# Altium schematic sheet Pompe de charge.SchDoc: =SchTitle
size 276 x 198 mm; Organization: ETML; Address1: Rue de Sébeillon12; Address2: CH - 1004 Lausanne; Address3: Tél. 021 316 77 77; Address4: www.etml.ch; SheetNumber: 4; SheetTotal: 4; Replace: .; ModA: .; ModB: .; ModC: .; ModD: .
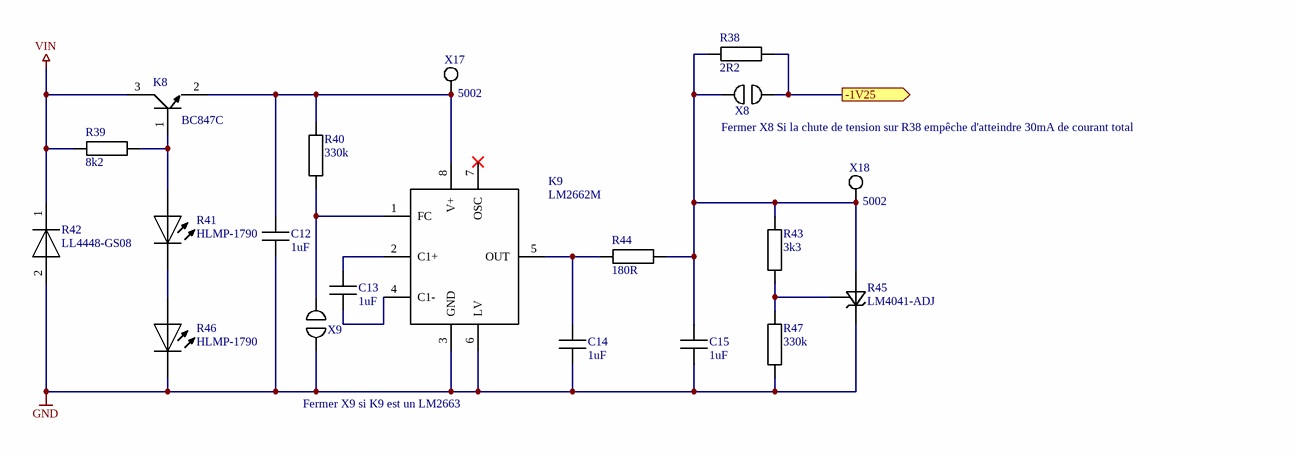
[diagram p0: Pompe de charge.SchDoc]

## Parts
C12  1uF  [CAPC2012X08M]
C13  1uF  [CAPC2012X08M]
C14  1uF  [CAPC2012X08M]
C15  1uF  [CAPC2012X08M]
K8  BC847C  [SOT90P240X110-3M]
K9  LM2662M  [D0008A_M]
R38  2R2  [RESC2012X06M]
R39  8k2  [RESC2012X06M]
R40  330k  [RESC2012X06M]
R41  HLMP-1790  [FP-6_544-5255_01-4-MFG]
R42  LL4448-GS08  [FP-6_560-5005_01-4-MFG]
R43  3k3  [RESC2012X06M]
R44  180R  [RESC2012X06M]
R45  LM4041-ADJ  [SOT90P240X110-3M]
R46  HLMP-1790  [FP-6_544-5255_01-4-MFG]
R47  330k  [RESC2012X06M]
X8  Solder bridge  [Solder brige]  (value not drawn)
X9  Solder bridge  [Solder brige]  (value not drawn)
X17  5002  [Keystone_5002]
X18  5002  [Keystone_5002]

## Ports
-1V25 (out)

## Nets
GND: C12.1 C14.1 C15.1 K9.3(GND) K9.6(LV) R42.2(A) R45.2(+V) R46.K R47.1 X9.1
VIN: K8.3(Emitter) R39.1 R42.1(C)
-1V25: R38.2 X8.1 ; port -1V25
NetC12_2: C12.2 K8.2(Collector) K9.8(V+) R40.2 X17.1(TP)
NetC13_1: C13.1 K9.4(C1-)
NetC13_2: C13.2 K9.2(C1+)
NetC14_2: C14.2 K9.5(OUT) R44.1
NetC15_2: C15.2 R38.1 R43.2 R44.2 R45.3(-V) X8.2 X18.1(TP)
NetK8_1: K8.1(Base) R39.2 R41.A
NetK9_1: K9.1(FC) R40.1 X9.2
NetR41_K: R41.K R46.A
NetR43_1: R43.1 R45.1(FB) R47.2

Not connected (* = marked no-connect by the designer): K9 7(OSC)*

## Notes on the sheet
- (near X8) Fermer X8 Si la chute de tension sur R38 empêche d'atteindre 30mA de courant total
- Fermer X9 si K9 est un LM2663
- a
- Dessiné
- A4
- Echelle :
- Mod.
- b
- c
- d
- Contrôlé
- Remplace
- Nb. feuilles
- Feuille n°
- Nom du projet
- No

## Library data of the parts
C12-C15 = CMP-065-000041-2: CAPC 1uF X5R 25V 10% 2012 (0805 INCH); Manufacturer: TDK; Manufacturer Number: KGM21AR51E105KU; Value: 1µF; TemperatureRange: -55°C to +85°C; IsStocked: 1; Supplier 1: Mouser; Category: Passives; Supplier Part Number 1: 581-KGM21AR51E105KU; SubCategory: Condensateurs ceramique; Tolerance: ±10%; Supplier Price 1: 1; Dielectric: X5R; Voltage: 25V; PN: KGM21AR51E105KU
K8 = BC847C: NPN general purpose transistor
K9 = LM2662M: Switched Capacitor Voltage Converter, 8-pin Narrow SOIC; Manufacturer: Texas Instruments; PackageTopMarking: NSZXTT*LM26*62M; PowerWise: N; CompType: Switch Caps; IsStocked: 1; PackageDescription: SOIC Narrow, 4.9 x 3.9 x 1.45mm, 8 Lead, 1.27mm Pitch; ComponentLink1URL: http://www.ti.com/general/docs/lit/getliterature.tsp?genericPartNumber=LM2662&fileType=pdf; PackageReference: D0008A; PinCount: 8; Code_JEDEC: MS-012-AA; ComponentLink1Description: Datasheet URL; RoHS: N; Code_IPC: SOIC127P600-8; PN: LM2662M; Supplier 1: Farnell; Supplier Part Number 1: 9306803; Supplier Price 1: 2.51
R38 = CMP-066-000155-2: RES 2.2ohm  ±1% 0.125W 2012 (0805 INCH); Manufacturer Number: RC0805FR-072R2L; Manufacturer: Yageo; TemperatureCoeff: ±200ppm/°C; Voltage: 150V; PN: PN-537077; Value: 2.2; TemperatureRange: -55°C to 155°C; IsStocked: 1; Supplier 1: ETML; Power: 0.125W; Category: Passives; Supplier Part Number 1: FAB.0805_R 2R2; SubCategory: Resistances couche epaisse; Supplier Price 1: 0.0200; Tolerance: ±1%
R39 = CMP-066-000198-2: RES 8.2kohm  ±1% 0.125W 2012 (0805 INCH); Manufacturer: Yageo; Manufacturer Number: RC0805FR-078K2L; TemperatureRange: -55°C to 155°C; TemperatureCoeff: ±200ppm/°C; IsStocked: 1; PN: PN-705867; Voltage: 150V; Value: 8.2k; Supplier Part Number 1: FAB.0805_R 8k2; Supplier Price 1: 0.0200; Supplier 1: ETML; Tolerance: ±1%; Category: Passives; SubCategory: Resistances couche epaisse; Power: 0.125W
R40 R47 = CMP-066-000217-2: RES 330kohm  ±1% 0.125W 2012 (0805 INCH); Manufacturer: Yageo; Manufacturer Number: RC0805FR-07330KL; PN: PN-717658; IsStocked: 1; Voltage: 150V; TemperatureCoeff: ±200ppm/°C; TemperatureRange: -55°C to 155°C; Tolerance: ±1%; Supplier 1: ETML; Power: 0.125W; Value: 330k; SubCategory: Resistances couche epaisse; Category: Passives; Supplier Part Number 1: FAB.0805_R 330k; Supplier Price 1: 0.0200
R41 R46 = HLMP-1790: HLMP-1790 2V 2mA; PN: MAG 355.161; IsStocked: 1; Supplier 1: ETML; Supplier Part Number 1: MAG 355.161; Supplier Price 1: 0.00
R42 = LL4448-GS08: DIODE GEN PURP 75V 150MA SOD80; Manufacturer: Vishay Small Signal; Max Junction Temp: +175°C; Automotive Grade: Grade 0; Capacitance: 4pF; Peak Reverse Current: 5uA; Forward Current: 300mA; Max Repetitive Reverse Voltage: 100V; Max Surge Forward Current: 2A; Value: 4pF; ComponentLink2Description: Datasheet; Height: 1.6mm; ComponentLink2URL: http://www.vishay.com/docs/85557/ll4148.pdf; Category: Diode; Lead Free: Yes; Device Class L3: Rectifier Diodes; Reverse Voltage: 75V; Mouser Description: Diodes - General Purpose, Power, Switching 100 Volt 100mA; RoHS: TRUE; Temperature: to +175°C; Automotive: Yes; Octopart: https://octopart.com/ll4448-gs08-vishay+small+signal-40886; Digikey Description: DIODE GEN PURP 75V 150MA SOD80; Manufacturer Part Number: LL4448-GS08; Temperature Range High: +175°C; Device Class L1: Discrete Semiconductors; Device Class L2: Diodes; Package: 6.560-5005.01-4
R43 = CMP-066-000193-2: RES 3.3kohm  ±1% 0.125W 2012 (0805 INCH); Manufacturer: Yageo; Manufacturer Number: RC0805FR-073K3L; Voltage: 150V; Value: 3.3k; TemperatureRange: -55°C to 155°C; TemperatureCoeff: ±200ppm/°C; IsStocked: 1; PN: PN-560659; SubCategory: Resistances couche epaisse; Supplier 1: ETML; Power: 0.125W; Category: Passives; Tolerance: ±1%; Supplier Part Number 1: FAB.0805_R 3k3; Supplier Price 1: 0.0200
R44 = CMP-066-000178-2: RES 180ohm  ±1% 0.125W 2012 (0805 INCH); Manufacturer: Yageo; Manufacturer Number: RC0805FR-07180RL; Value: 180; TemperatureRange: -55°C to 155°C; TemperatureCoeff: ±200ppm/°C; PN: PN-125035; Voltage: 150V; IsStocked: 1; SubCategory: Resistances couche epaisse; Power: 0.125W; Tolerance: ±1%; Supplier 1: ETML; Supplier Price 1: 0.0200; Supplier Part Number 1: FAB.0805_R 180R; Category: Passives
R45 = LM4041: Precision Micropower Shunt Voltage Reference, 3-pin SOT-23; Manufacturer: Texas Instruments; PowerWise: N; PackageTopMarking: RAC*XTT; CompType: Voltage Reference IC; DatasheetVersion: Mar-2005; PackageDescription: Molded SOT-23, .115 x .051 x .037in Body, 3 Lead, .075 in Pitch; PackageReference: DBZ0003A; PinCount: 3; PackageVersion: revB, Mar-2003; ComponentLink1URL: http://www.ti.com/general/docs/lit/getliterature.tsp?genericPartNumber=LM4041-N&fileType=pdf; RevisionNote: Component URLs added; RoHS: N; ComponentLink1Description: Datasheet URL
X17 X18 = CMP-054-000004-1: TEST THT MINIATURE WT; Manufacturer: Keystone; PN: PN-357949; IsStocked: True; Category: Connectors; Value: 5002; Supplier Part Number 1: MAG.428.013; Supplier 1: ETML; Supplier Price 1: 0.2931; SubCategory: Testpoints; Manufacturer Number: 5002